# EAGLE board VCFA_bjt (EAGLE 9.4.2)
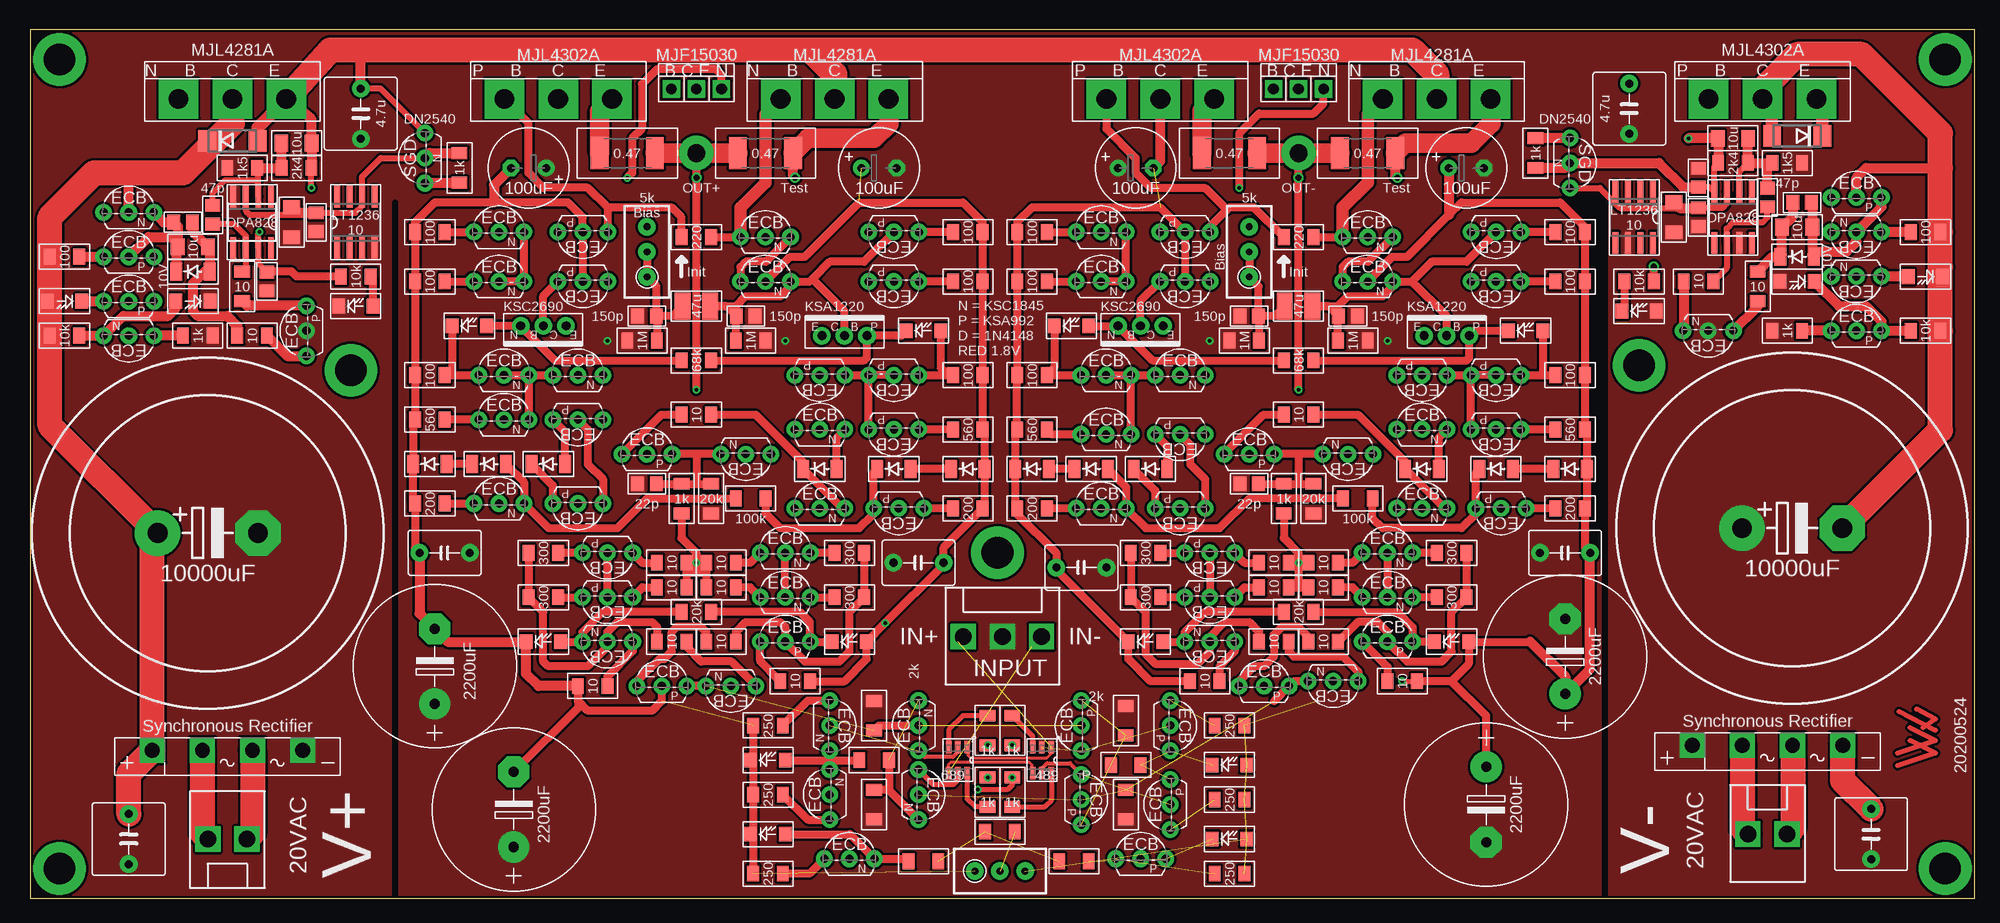
[diagram p3: board, top side]
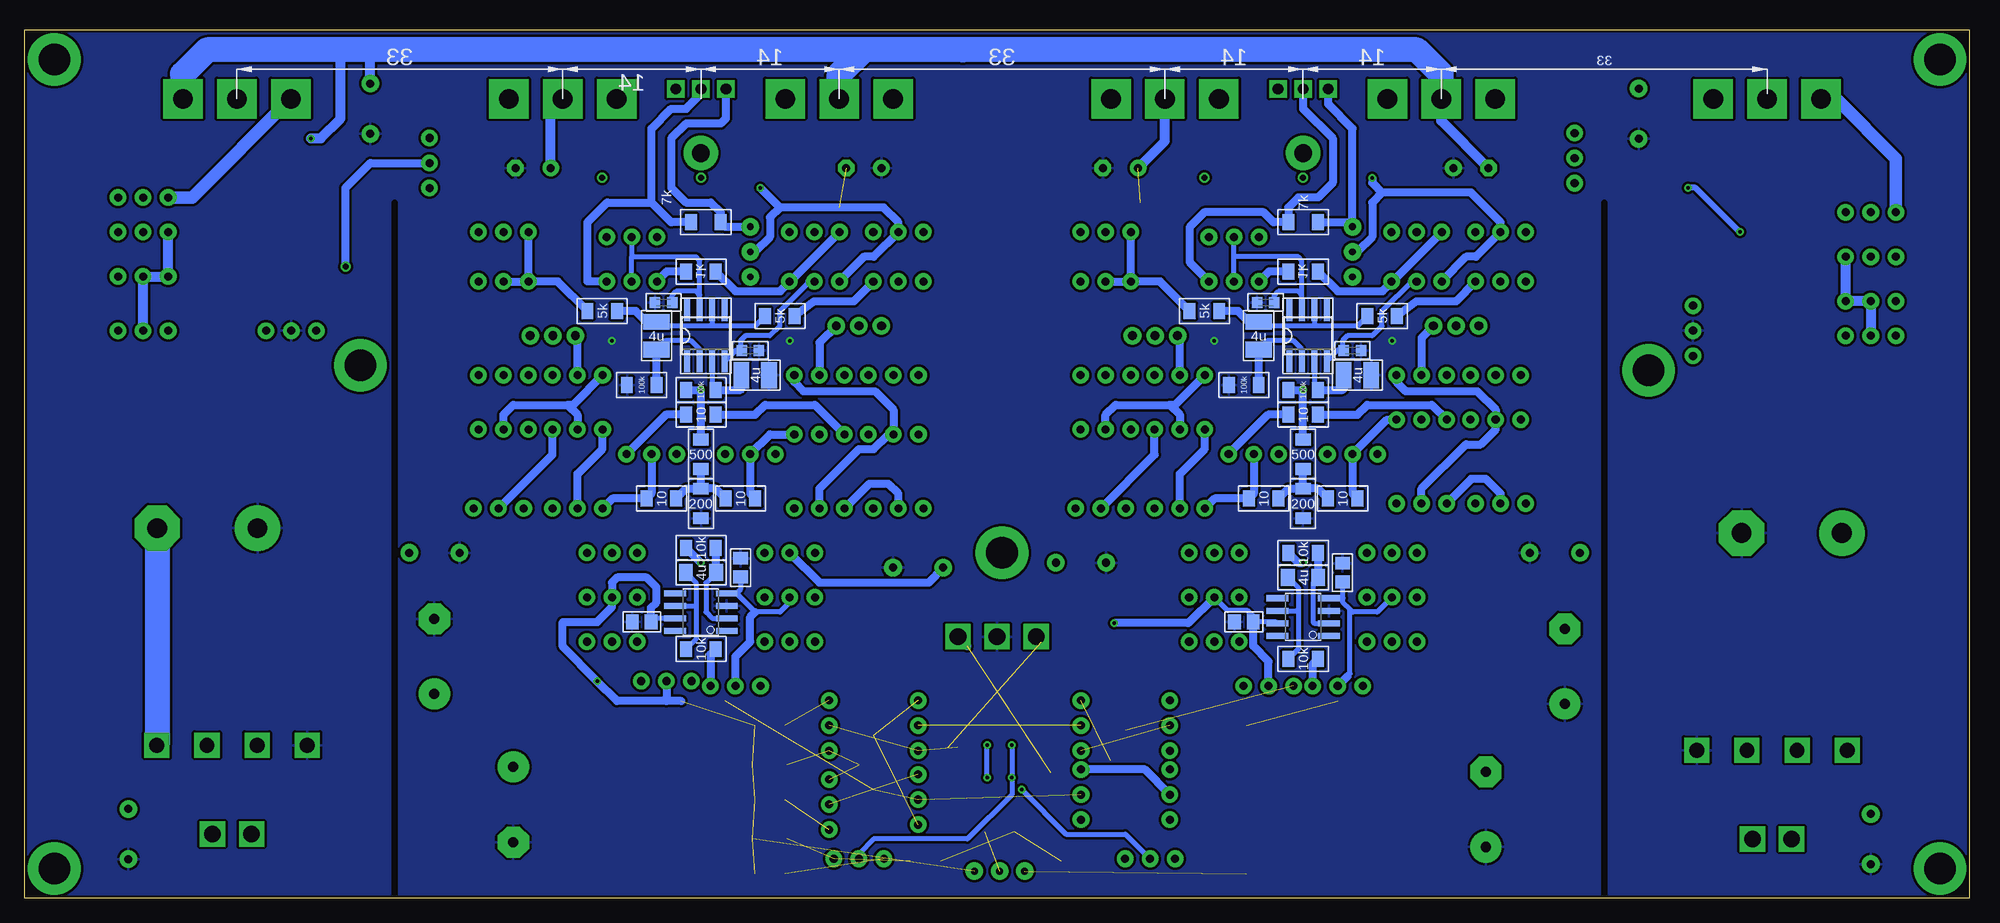
[diagram p4: board, bottom side, seen from below]

Size 197 x 88 mm. Coordinates in mm from the lower left corner, seen from the top.
Outline: 0,0 197,0 197,88 0,88 0,0
Copper layers (1*16): Top 0.035mm / dielectric 1.5mm / Bottom 0.035mm
Design rules "default *": minimum track width 6mil, minimum drill 0.35mm, track to track 6mil, track to pad 6mil, pad to pad 6mil, via to via 6mil, smd to smd 0mil, copper to edge 10mil, drill to drill 6mil, minimum pad ring 10mil, minimum via ring 8mil, stop-mask expansion 4mil, vias tented up to drill 0.35mm, thermal gap 10mil
tRestrict: 2 lines
bRestrict: 2 lines

## Footprints (pad centres in the part's own frame; a part is rotated, then mirrored left to right if it is on the bottom)
GBU4S = drill 1.499 pad 2.54 square: + 7.62,0; - -7.62,0; AC1 2.54,0; AC2 -2.54,0
E7,5-16 = drill 1.016 pad 3.15: + -3.81,0 | drill 1.016 pad 3.15 octagon: - 3.81,0
C0805 = smd 1.3 x 1.5: 1 -0.95,0; 2 0.95,0
C050-045X075 = drill 0.813 pad 1.778: 1 -2.54,0; 2 2.54,0
C1206 = smd 1.4 x 1.7: 1 -1.527,0; 2 1.527,0
C1210 = smd 1.6 x 2.7: 1 -1.4,0; 2 1.4,0
C0603K = smd 1.05 x 1.08: 1 -0.875,0; 2 0.875,0
E3,5-8 = drill 0.813 pad 1.676: + -1.778,0 | drill 0.813 pad 1.676 octagon: - 1.778,0
EB35D = drill 2.007 pad 4.597: + -5.08,0 | drill 2.007 pad 4.597 octagon: - 5.08,0
C050-075X075 = drill 0.813 pad 1.778: 1 -2.54,0; 2 2.54,0
SOD80C = smd 1.2 x 1.8: A 1.7,0; C -1.7,0
DO214AA = smd 1.8 x 2.2: A 2.55,0; C -2.55,0
SO8 = smd 0.6 x 2.2: 1 -1.905,-2.6; 2 -0.635,-2.6; 3 0.635,-2.6; 4 1.905,-2.6; 5 1.905,2.6; 6 0.635,2.6; 7 -0.635,2.6; 8 -1.905,2.6
M3_HOLE = drill 3.2 pad 5.334: P$1 0,0
SO08 = smd 0.61 x 2.21: 1 -1.905,-2.616; 2 -0.635,-2.616; 3 0.635,-2.616; 4 1.905,-2.616; 5 1.905,2.616; 6 0.635,2.616; 7 -0.635,2.616; 8 -1.905,2.616
SOIC8 = smd 0.6 x 2.2: 1 -1.905,-2.6; 2 -0.635,-2.6; 3 0.635,-2.6; 4 1.905,-2.6; 5 1.905,2.6; 6 0.635,2.6; 7 -0.635,2.6; 8 -1.905,2.6
LED_SML1206 = smd 1.3 x 1.5: A 1.75,0; C -1.75,0
PAD-16 = drill 1.8 pad 3.5: P$1 0,0
SOT-23-6 = smd 1.27 x 0.559: 1 -1.295,0.95; 2 -1.295,0; 3 -1.295,-0.95; 4 1.295,-0.95; 5 1.295,0; 6 1.295,0.95
TRANSISTOR_TO92-ECB_P = drill 0.813 pad 1.676: B 2.54,0; C 0,0; E -2.54,0
TRANSISTOR_TO92-ECB_N = drill 0.813 pad 1.676: B 2.54,0; C 0,0; E -2.54,0
TRANSISTOR_TO126_P = drill 0.9 pad 1.778: B 2.286,0; C 0,0; E -2.286,0
TRANSISTOR_TO126_N = drill 0.9 pad 1.778: B 2.286,0; C 0,0; E -2.286,0
TRANSISTOR_TO220_BCE_N = drill 1.1 pad 1.778 square: B -2.54,0; C 0,0; E 2.54,0
TRANSISTOR_TO247_BCE_N = drill 2 pad 4 square: B -5.461,0; C 0,0; E 5.461,0
TRANSISTOR_TO247_BCE_P = drill 2 pad 4 square: B -5.461,0; C 0,0; E 5.461,0
TRANSISTOR_TO92-SGD_N = drill 0.813 pad 1.676: D 2.54,0; G 0,0; S -2.54,0
RTRIM3296W = drill 0.7 pad 1.778: 1 0,-2.54; 2 0,0; 3 0,2.54
MINI_MELF-0204W = smd 1.2 x 1.6: 1 -1.5,0; 2 1.5,0
R2512 = smd 1.8 x 3.2: 1 -2.8,0; 2 2.8,0
KK-156-3 = drill 1.7 pad 2.54 square: 1 -3.96,0; 2 0,0; 3 3.96,0
KK-156-2 = drill 1.7 pad 2.54 square: 1 -1.98,0; 2 1.98,0

## Placement (x,y rotation side)
B1  MOS_BRIDGE  [GBU4S]  20,15 180 top
B2  MOS_BRIDGE  [GBU4S]  176,15.5 180 top
C1  1000uF  [E7,5-16]  155.5,24.5 90 top
C2  1000uF  [E7,5-16]  41,23.5 90 top
C3  0.1uF  [C0805]  73.5,28 0 bottom
C4  0.1uF  [C0805]  63.5,33 90 bottom
C6  1000uF  [E7,5-16]  49,9 90 top
C7  1000uF  [E7,5-16]  147.5,9.5 270 top
C9  0.1uF  [C050-045X075]  90,34 180 top
C10  0.1uF  [C050-045X075]  106.5,33.5 180 top
C11  0.1uF  [C050-045X075]  155.5,35 180 top
C12  0.1uF  [C050-045X075]  42,35 180 top
C13  10uF  [C1206]  67.5,32.5 0 bottom
C14  0.1uF  [C0805]  134.5,28 0 bottom
C15  0.1uF  [C0805]  124.5,33.5 90 bottom
C16  10uF  [C1206]  128.5,33 0 bottom
C17  22p  [C0805]  62.5,42 180 top
C18  47u  [C1210]  67.5,60 180 top
C19  150p  [C0805]  72.5,59 180 top
C20  150p  [C0805]  62.5,59 180 top
C21  4.7uF  [C1210]  72,57 270 bottom
C22  4.7uF  [C1210]  62,53 180 bottom
C23  0.1uF  [C0603K]  71.29,60.36 180 bottom
C24  0.1uF  [C0603K]  62.5,55.5 180 bottom
C25  100uF  [E3,5-8]  86,74 0 top
C26  100uF  [E3,5-8]  50.5,74 180 top
C27  22p  [C0805]  123.5,42 180 top
C28  47u  [C1210]  128.5,60 180 top
C29  150p  [C0805]  133.5,59 180 top
C30  150p  [C0805]  123.5,59 180 top
C31  4.7uF  [C1210]  133,57 270 bottom
C32  4.7uF  [C1210]  123,53 180 bottom
C33  0.1uF  [C0603K]  132.29,60.36 180 bottom
C34  0.1uF  [C0603K]  123.5,55.5 180 bottom
C35  100uF  [E3,5-8]  145.5,74 0 top
C36  100uF  [E3,5-8]  112,74 0 top
C37  10000uF  [EB35D]  18,37 0 top
C38  10000uF  [EB35D]  178.5,37.5 0 top
C39  0.1uF  [C050-075X075]  186.5,6.5 90 top
C40  10uF  [C1206]  16.5,66 0 top
C41  10uF  [C1206]  179,68 0 top
C42  0.1uF  [C050-075X075]  10,6 270 top
C43  0.1uF  [C0805]  15.5,68.5 0 top
C44  0.1uF  [C0805]  179.5,70.5 0 top
C45  0.1uF  [C0805]  24,62.5 90 top
C46  0.1uF  [C0805]  169,73 90 top
C47  10uF  [C1206]  26.5,68.5 270 top
C48  10uF  [C1206]  166.5,69 90 top
C49  0.1uF  [C0805]  29,68.5 270 top
C50  0.1uF  [C0805]  169,69 90 top
C51  47p  [C0805]  18.5,69.25 90 top
C52  47p  [C0805]  176,71 90 top
C53  10uF  [C1206]  27,76.5 180 top
C54  10uF  [C1206]  172.5,77 180 top
C55  4.7uF  [C050-075X075]  33.5,79.5 90 top
C56  4.7uF  [C050-075X075]  162,80 270 top
D1  LL4148  [SOD80C]  95,43.5 0 top
D2  LL4148  [SOD80C]  87.5,43.5 0 top
D3  LL4148  [SOD80C]  46.5,44 0 top
D4  LL4148  [SOD80C]  40.5,44 0 top
D5  LL4148  [SOD80C]  80,43.5 0 top
D6  LL4148  [SOD80C]  52.5,44 0 top
D7  LL4148  [SOD80C]  156,43.5 0 top
D8  LL4148  [SOD80C]  148.5,43.5 0 top
D9  LL4148  [SOD80C]  107.5,43.5 0 top
D10  LL4148  [SOD80C]  101.5,43.5 0 top
D11  LL4148  [SOD80C]  141,43.5 0 top
D12  LL4148  [SOD80C]  113.5,43.5 0 top
D13  BZT55B10  [SOD80C]  16.5,63.5 0 top
D14  BZT55B10  [SOD80C]  179,65 0 top
D15  S1G  [DO214AA]  20.5,76.75 0 top
D16  S1G  [DO214AA]  179,77.25 180 top
D17  LT1236-10  [SO8]  33,68.5 0 top
D18  LT1236-10  [SO8]  162.5,69 180 top
H1  HOLE  [M3_HOLE]  3,3 0 top
H2  HOLE  [M3_HOLE]  194,3 0 top
H3  HOLE  [M3_HOLE]  3,85 0 bottom
H4  HOLE  [M3_HOLE]  194,85 0 top
H5  HOLE  [M3_HOLE]  32.5,53.5 0 top
H6  HOLE  [M3_HOLE]  98,35 0 top
H7  HOLE  [M3_HOLE]  163,54 0 top
IC1  LTC2057HV  [SO08]  67.5,28.5 90 bottom
IC2  LTC2057HV  [SO08]  128.5,29 90 bottom
IC3  LTC2057HV  [SOIC8]  67,57 0 bottom
IC4  LTC2057HV  [SOIC8]  128,57 0 bottom
IC5  OPA827  [SOIC8]  172.5,69 180 top
IC6  OPA827  [SOIC8]  22.5,68.5 180 top
LED1  RED  [LED_SML1206]  121.5,6 0 top
LED2  RED  [LED_SML1206]  74.75,6.5 0 top
LED3  RED  [LED_SML1206]  121.5,13.5 0 top
LED4  RED  [LED_SML1206]  74.75,14 0 top
LED5  RED  [LED_SML1206]  83,26 0 top
LED6  RED  [LED_SML1206]  52,26 0 top
LED7  RED  [LED_SML1206]  144,26 0 top
LED8  RED  [LED_SML1206]  113,26 0 top
LED9  RED  [LED_SML1206]  90.5,57.5 0 top
LED10  RED  [LED_SML1206]  44.5,58 0 top
LED11  RED  [LED_SML1206]  151.5,57.5 0 top
LED12  RED  [LED_SML1206]  105.5,58 0 top
LED13  RED  [LED_SML1206]  16.5,60.5 180 top
LED14  RED  [LED_SML1206]  179,62.5 180 top
LED15  RED  [LED_SML1206]  3.5,60.5 180 top
LED16  RED  [LED_SML1206]  192,63 180 top
LED17  RED  [LED_SML1206]  33,60 0 top
LED18  RED  [LED_SML1206]  163,59.5 0 top
PAD1  PAD  [PAD-16]  67.5,75.5 0 top
PAD2  PAD  [PAD-16]  128.5,75.5 0 top
Q1  LSK689  [SOT-23-6]  94,14 270 top
Q2  KSA992  [TRANSISTOR_TO92-ECB_P]  112.5,4 0 top
Q3  KSC1845  [TRANSISTOR_TO92-ECB_N]  83,4 0 top
Q4  LSK489  [SOT-23-6]  102.5,14 270 top
Q5  KSA992  [TRANSISTOR_TO92-ECB_P]  115.5,9.5 90 top
Q6  KSC1845  [TRANSISTOR_TO92-ECB_N]  90,10.5 270 top
Q7  KSC1845  [TRANSISTOR_TO92-ECB_N]  90,17.5 90 top
Q8  KSA992  [TRANSISTOR_TO92-ECB_P]  106.5,10 270 top
Q9  KSC1845  [TRANSISTOR_TO92-ECB_N]  71,21.5 180 top
Q10  KSA992  [TRANSISTOR_TO92-ECB_P]  64,21.5 0 top
Q11  KSA992  [TRANSISTOR_TO92-ECB_P]  76.5,26 0 top
Q12  KSC1845  [TRANSISTOR_TO92-ECB_N]  58.5,26 180 top
Q13  KSC1845  [TRANSISTOR_TO92-ECB_N]  76.5,35 0 top
Q14  KSA992  [TRANSISTOR_TO92-ECB_P]  58.5,35 180 top
Q15  KSC1845  [TRANSISTOR_TO92-ECB_N]  76.5,30.5 0 top
Q16  KSA992  [TRANSISTOR_TO92-ECB_P]  58.5,30.5 180 top
Q17  KSC1845  [TRANSISTOR_TO92-ECB_N]  132,22 180 top
Q18  KSA992  [TRANSISTOR_TO92-ECB_P]  125,21.5 0 top
Q19  KSA992  [TRANSISTOR_TO92-ECB_P]  137.5,26 0 top
Q20  KSC1845  [TRANSISTOR_TO92-ECB_N]  119.5,26 180 top
Q21  KSC1845  [TRANSISTOR_TO92-ECB_N]  137.5,35 0 top
Q22  KSA992  [TRANSISTOR_TO92-ECB_P]  119.5,35 180 top
Q23  KSC1845  [TRANSISTOR_TO92-ECB_N]  137.5,30.5 0 top
Q24  KSA992  [TRANSISTOR_TO92-ECB_P]  119.5,30.5 180 top
Q25  KSA992  [TRANSISTOR_TO92-ECB_P]  88,39.5 180 top
Q26  KSA992  [TRANSISTOR_TO92-ECB_P]  62.5,45 0 top
Q27  KSC1845  [TRANSISTOR_TO92-ECB_N]  72.5,45 180 top
Q28  KSC1845  [TRANSISTOR_TO92-ECB_N]  47.5,40 0 top
Q29  KSC1845  [TRANSISTOR_TO92-ECB_N]  80,47.5 0 top
Q30  KSC1845  [TRANSISTOR_TO92-ECB_N]  80,39.5 0 top
Q31  KSA992  [TRANSISTOR_TO92-ECB_P]  55.5,48.5 180 top
Q32  KSA992  [TRANSISTOR_TO92-ECB_P]  55.5,40 180 top
Q33  KSA992  [TRANSISTOR_TO92-ECB_P]  87.5,47.5 180 top
Q34  KSC1845  [TRANSISTOR_TO92-ECB_N]  48,48.5 0 top
Q35  KSA992  [TRANSISTOR_TO92-ECB_P]  87.5,53 180 top
Q36  KSA992  [TRANSISTOR_TO92-ECB_P]  80,53 180 top
Q37  KSC1845  [TRANSISTOR_TO92-ECB_N]  55.5,53 0 top
Q38  KSC1845  [TRANSISTOR_TO92-ECB_N]  48,53 0 top
Q39  KSA1220  [TRANSISTOR_TO126_P]  82.5,57 0 top
Q40  KSC2690  [TRANSISTOR_TO126_N]  52,58 180 top
Q41  KSA992  [TRANSISTOR_TO92-ECB_P]  87.5,62.5 180 top
Q42  KSC1845  [TRANSISTOR_TO92-ECB_N]  47.5,62.5 0 top
Q43  KSA992  [TRANSISTOR_TO92-ECB_P]  87.5,67.5 180 top
Q44  KSC1845  [TRANSISTOR_TO92-ECB_N]  47.5,67.5 0 top
Q45  MJE15030  [TRANSISTOR_TO220_BCE_N]  67.5,82 0 top
Q46  KSC1845  [TRANSISTOR_TO92-ECB_N]  74.5,62.5 0 top
Q47  KSA992  [TRANSISTOR_TO92-ECB_P]  56,62.5 180 top
Q48  KSC1845  [TRANSISTOR_TO92-ECB_N]  74.5,67 0 top
Q49  KSA992  [TRANSISTOR_TO92-ECB_P]  56,67.5 180 top
Q50  MJL4281A  [TRANSISTOR_TO247_BCE_N]  81.5,81 0 top
Q51  MJL4302A  [TRANSISTOR_TO247_BCE_P]  53.5,81 0 top
Q52  KSA992  [TRANSISTOR_TO92-ECB_P]  149,39.5 180 top
Q53  KSA992  [TRANSISTOR_TO92-ECB_P]  123.5,45 0 top
Q54  KSC1845  [TRANSISTOR_TO92-ECB_N]  133.5,45 180 top
Q55  KSC1845  [TRANSISTOR_TO92-ECB_N]  108.5,39.5 0 top
Q56  KSC1845  [TRANSISTOR_TO92-ECB_N]  141,47.5 0 top
Q57  KSC1845  [TRANSISTOR_TO92-ECB_N]  141,39.5 0 top
Q58  KSA992  [TRANSISTOR_TO92-ECB_P]  116.5,47 180 top
Q59  KSA992  [TRANSISTOR_TO92-ECB_P]  116.5,39.5 180 top
Q60  KSA992  [TRANSISTOR_TO92-ECB_P]  148.5,47.5 180 top
Q61  KSC1845  [TRANSISTOR_TO92-ECB_N]  109,47 0 top
Q62  KSA992  [TRANSISTOR_TO92-ECB_P]  148.5,53 180 top
Q63  KSA992  [TRANSISTOR_TO92-ECB_P]  141,53 180 top
Q64  KSC1845  [TRANSISTOR_TO92-ECB_N]  116.5,53 0 top
Q65  KSC1845  [TRANSISTOR_TO92-ECB_N]  109,53 0 top
Q66  KSA1220  [TRANSISTOR_TO126_P]  143.5,57 0 top
Q67  KSC2690  [TRANSISTOR_TO126_N]  112.5,58 180 top
Q68  KSA992  [TRANSISTOR_TO92-ECB_P]  148.5,62.5 180 top
Q69  KSC1845  [TRANSISTOR_TO92-ECB_N]  108.5,62.5 0 top
Q70  KSA992  [TRANSISTOR_TO92-ECB_P]  148.5,67.5 180 top
Q71  KSC1845  [TRANSISTOR_TO92-ECB_N]  108.5,67.5 0 top
Q72  MJE15030  [TRANSISTOR_TO220_BCE_N]  128.5,82 0 top
Q73  KSC1845  [TRANSISTOR_TO92-ECB_N]  135.5,62.5 0 top
Q74  KSA992  [TRANSISTOR_TO92-ECB_P]  117,62.5 180 top
Q75  KSC1845  [TRANSISTOR_TO92-ECB_N]  135.5,67 0 top
Q76  KSA992  [TRANSISTOR_TO92-ECB_P]  117,67.5 180 top
Q77  MJL4281A  [TRANSISTOR_TO247_BCE_N]  142.5,81 0 top
Q78  MJL4302A  [TRANSISTOR_TO247_BCE_P]  114.5,81 0 top
Q79  KSC1845  [TRANSISTOR_TO92-ECB_N]  10,57 180 top
Q80  KSA992  [TRANSISTOR_TO92-ECB_P]  185,57.5 0 top
Q81  KSA992  [TRANSISTOR_TO92-ECB_P]  10,60.5 0 top
Q82  KSC1845  [TRANSISTOR_TO92-ECB_N]  185,63 180 top
Q83  KSA992  [TRANSISTOR_TO92-ECB_P]  10,65 0 top
Q84  KSC1845  [TRANSISTOR_TO92-ECB_N]  185,67.5 180 top
Q85  KSA992  [TRANSISTOR_TO92-ECB_P]  28,57.5 90 top
Q86  KSC1845  [TRANSISTOR_TO92-ECB_N]  170,57.5 180 top
Q87  KSC1845  [TRANSISTOR_TO92-ECB_N]  10,69.5 0 top
Q88  KSA992  [TRANSISTOR_TO92-ECB_P]  185,71 0 top
Q89  MJL4281A  [TRANSISTOR_TO247_BCE_N]  20.5,81 0 top
Q90  MJL4302A  [TRANSISTOR_TO247_BCE_P]  175.5,81 0 top
Q91  DN2540  [TRANSISTOR_TO92-SGD_N]  40,75 90 top
Q92  DN2540  [TRANSISTOR_TO92-SGD_N]  156,74.5 270 top
Q93  KSA992  [TRANSISTOR_TO92-ECB_P]  115.5,17.5 270 top
Q94  KSA992  [TRANSISTOR_TO92-ECB_P]  106.5,17.5 90 top
Q95  KSC1845  [TRANSISTOR_TO92-ECB_N]  81,17.5 270 top
Q96  KSC1845  [TRANSISTOR_TO92-ECB_N]  81,10.5 90 top
R1  5k  [RTRIM3296W]  98.25,2.75 270 top
R2  10K  [MINI_MELF-0204W]  98.25,6.75 0 top
R3  10K  [MINI_MELF-0204W]  105.75,3.75 0 top
R4  10K  [MINI_MELF-0204W]  90.5,3.75 0 top
R5  250  [MINI_MELF-0204W]  121.5,2.5 0 top
R6  1K  [MINI_MELF-0204W]  97,17 270 top
R7  250  [MINI_MELF-0204W]  74.75,2.5 0 top
R8  1K  [MINI_MELF-0204W]  97,10.75 90 top
R9  1K  [MINI_MELF-0204W]  99.5,17 90 top
R10  1K  [MINI_MELF-0204W]  99.5,10.75 270 top
R11  2k  [MINI_MELF-0204W]  85.5,18.5 270 top
R12  250  [MINI_MELF-0204W]  121.5,17.5 0 top
R13  250  [MINI_MELF-0204W]  74.75,17.5 0 top
R14  10K  [MINI_MELF-0204W]  111,13.5 0 top
R15  10K  [MINI_MELF-0204W]  111,18 270 top
R16  10K  [MINI_MELF-0204W]  85.5,9.5 270 top
R17  10K  [MINI_MELF-0204W]  85.5,14 0 top
R18  250  [MINI_MELF-0204W]  121.5,10 0 top
R19  250  [MINI_MELF-0204W]  74.75,10.5 0 top
R20  2k  [MINI_MELF-0204W]  111,9.5 90 top
R21  10K  [MINI_MELF-0204W]  67.5,24.25 0 bottom
R22  20K  [MINI_MELF-0204W]  67.5,29 0 top
R23  250  [MINI_MELF-0204W]  77.5,22 0 top
R24  10  [MINI_MELF-0204W]  70,26 180 top
R25  10  [MINI_MELF-0204W]  65,26 180 top
R26  250  [MINI_MELF-0204W]  57,21.5 0 top
R27  300  [MINI_MELF-0204W]  83,35 0 top
R28  300  [MINI_MELF-0204W]  52,35 0 top
R29  10K  [MINI_MELF-0204W]  67.5,35 0 bottom
R30  10  [MINI_MELF-0204W]  70,34 0 top
R31  10  [MINI_MELF-0204W]  65,34 0 top
R32  300  [MINI_MELF-0204W]  83,30.5 0 top
R33  300  [MINI_MELF-0204W]  52,30.5 0 top
R34  10  [MINI_MELF-0204W]  70,31.5 0 top
R35  10  [MINI_MELF-0204W]  65,31.5 0 top
R36  10K  [MINI_MELF-0204W]  128.5,25.25 0 bottom
R37  20K  [MINI_MELF-0204W]  128.5,29 0 top
R38  250  [MINI_MELF-0204W]  139,22 0 top
R39  10  [MINI_MELF-0204W]  131,26 180 top
R40  10  [MINI_MELF-0204W]  126,26 180 top
R41  250  [MINI_MELF-0204W]  119,22 0 top
R42  300  [MINI_MELF-0204W]  144,35 0 top
R43  300  [MINI_MELF-0204W]  113,35 0 top
R44  10K  [MINI_MELF-0204W]  128.5,35.5 0 bottom
R45  10  [MINI_MELF-0204W]  131,34 0 top
R46  10  [MINI_MELF-0204W]  126,34 0 top
R47  300  [MINI_MELF-0204W]  144,30.5 0 top
R48  300  [MINI_MELF-0204W]  113,30.5 0 top
R49  10  [MINI_MELF-0204W]  131,31.5 0 top
R50  10  [MINI_MELF-0204W]  126,31.5 0 top
R51  1k  [MINI_MELF-0204W]  66,40.5 270 top
R52  20k  [MINI_MELF-0204W]  69,40.5 90 top
R53  100k  [MINI_MELF-0204W]  73,40.5 0 top
R54  200  [MINI_MELF-0204W]  95,39.5 0 top
R55  10  [MINI_MELF-0204W]  67.5,49 0 top
R56  10  [MINI_MELF-0204W]  67.5,49 180 bottom
R57  200  [MINI_MELF-0204W]  40.5,40 0 top
R58  560  [MINI_MELF-0204W]  95,47.5 0 top
R59  10  [MINI_MELF-0204W]  71.5,40.5 180 bottom
R60  10  [MINI_MELF-0204W]  63.5,40.5 180 bottom
R61  560  [MINI_MELF-0204W]  40.5,48.5 0 top
R62  100  [MINI_MELF-0204W]  95,53 0 top
R63  200  [MINI_MELF-0204W]  67.5,40 90 bottom
R64  100  [MINI_MELF-0204W]  40.5,53 0 top
R65  68k  [MINI_MELF-0204W]  67.5,54.5 0 top
R66  500  [MINI_MELF-0204W]  67.5,45 90 bottom
R67  100  [MINI_MELF-0204W]  95,62.5 0 top
R68  5k  [MINI_MELF-0204W]  77.5,59.5 180 bottom
R69  5k  [MINI_MELF-0204W]  59.5,59 180 bottom
R70  100  [MINI_MELF-0204W]  40.5,62.5 0 top
R71  100  [MINI_MELF-0204W]  95,67.5 0 top
R72  100  [MINI_MELF-0204W]  40.5,67.5 0 top
R73  7k  [MINI_MELF-0204W]  67.5,68.5 180 bottom
R74  5k  [RTRIM3296W]  62.5,65.5 0 top
R75  1M  [MINI_MELF-0204W]  73,56.5 0 top
R76  1M  [MINI_MELF-0204W]  62,56.5 0 top
R77  1k  [MINI_MELF-0204W]  67.5,63.5 180 bottom
R78  220  [MINI_MELF-0204W]  67.5,67 0 top
R79  100k  [MINI_MELF-0204W]  73.5,52 0 bottom
R80  0.5  [R2512]  74.5,75.5 0 top
R81  0.5  [R2512]  60.5,75.5 0 top
R82  100k  [MINI_MELF-0204W]  67.5,51.5 0 bottom
R83  1k  [MINI_MELF-0204W]  127,40.5 270 top
R84  20k  [MINI_MELF-0204W]  130,40.5 90 top
R85  100k  [MINI_MELF-0204W]  134.5,40.5 0 top
R86  200  [MINI_MELF-0204W]  156,39.5 0 top
R87  10  [MINI_MELF-0204W]  128.5,49 0 top
R88  10  [MINI_MELF-0204W]  128.5,49 180 bottom
R89  200  [MINI_MELF-0204W]  101.5,39.5 0 top
R90  560  [MINI_MELF-0204W]  156,47.5 0 top
R91  10  [MINI_MELF-0204W]  132.5,40.5 180 bottom
R92  10  [MINI_MELF-0204W]  124.5,40.5 180 bottom
R93  560  [MINI_MELF-0204W]  101.5,47.5 0 top
R94  100  [MINI_MELF-0204W]  156,53 0 top
R95  200  [MINI_MELF-0204W]  128.5,40 90 bottom
R96  100  [MINI_MELF-0204W]  101.5,53 0 top
R97  68k  [MINI_MELF-0204W]  128.5,54.5 0 top
R98  500  [MINI_MELF-0204W]  128.5,45 90 bottom
R99  100  [MINI_MELF-0204W]  156,62.5 0 top
R100  5k  [MINI_MELF-0204W]  138.5,59.5 180 bottom
R101  5k  [MINI_MELF-0204W]  120.5,59 180 bottom
R102  100  [MINI_MELF-0204W]  101.5,62.5 0 top
R103  100  [MINI_MELF-0204W]  156,67.5 0 top
R104  100  [MINI_MELF-0204W]  101.5,67.5 0 top
R105  7k  [MINI_MELF-0204W]  128,68.5 180 bottom
R106  5k  [RTRIM3296W]  123.5,65.5 0 top
R107  1M  [MINI_MELF-0204W]  134,56.5 0 top
R108  1M  [MINI_MELF-0204W]  123,56.5 0 top
R109  1k  [MINI_MELF-0204W]  128.5,63.5 180 bottom
R110  220  [MINI_MELF-0204W]  128.5,67 0 top
R111  100k  [MINI_MELF-0204W]  134.5,52 0 bottom
R112  0.5  [R2512]  135.5,75.5 0 top
R113  0.5  [R2512]  121.5,75.5 0 top
R114  100k  [MINI_MELF-0204W]  128.5,51.5 0 bottom
R115  10k  [MINI_MELF-0204W]  3.5,57 0 top
R116  10k  [MINI_MELF-0204W]  192,57.5 0 top
R117  1k  [MINI_MELF-0204W]  17,57 0 top
R118  1k  [MINI_MELF-0204W]  178,57.5 0 top
R119  100  [MINI_MELF-0204W]  3.5,65 0 top
R120  10  [MINI_MELF-0204W]  22.5,57 0 top
R121  10  [MINI_MELF-0204W]  175,62 90 top
R122  100  [MINI_MELF-0204W]  192,67.5 0 top
R123  10  [MINI_MELF-0204W]  21.5,62 270 top
R124  10  [MINI_MELF-0204W]  169,62.5 180 top
R125  1k  [MINI_MELF-0204W]  43.5,74 270 top
R126  1k  [MINI_MELF-0204W]  152.5,75.5 90 top
R127  1.5k  [MINI_MELF-0204W]  27,74 0 top
R128  1.5k  [MINI_MELF-0204W]  21.5,74 0 top
R129  1.5k  [MINI_MELF-0204W]  178,74.5 0 top
R130  1.5k  [MINI_MELF-0204W]  172.5,74.5 0 top
R131  10k  [MINI_MELF-0204W]  33,63 180 top
R132  10k  [MINI_MELF-0204W]  163,62.5 180 top
S1  VWV  [VWV]  193,16 90 top
X1  KK-156-3  [KK-156-3]  98.5,26.5 0 top
X3  KK-156-2  [KK-156-2]  20,6 180 top
X4  KK-156-2  [KK-156-2]  176,6.5 0 top

## Tracks (layer width: path | path; a pad name or v marks a point on that pad's centre or on a via)
BOUT+  (via drill 0.35)
  Top 0.813: R31.2 66.5,33 | 66.5,33 R35.2 | R30.1 68.5,33 | 68.5,33 R34.1 | 66.5,33 67.5,33 | 67.5,33 68.5,33 | R51.2 66,36.5 67.5,35 v67.5,34 67.5,33
  Bottom 0.813: R29.1 68,34 v67.5,34
BOUT-  (via drill 0.35)
  Top 0.813: R46.2 v128.5,34 | v128.5,34 R45.1 | R50.2 128.5,31.5 | 128.5,31.5 R49.1 | v128.5,34 128.5,31.5 | R83.2 127,36.5 128.5,35 v128.5,34
  Bottom 0.813: R44.1 v128.5,34
GND  (via drill 0.35)
  other vias: 137.5,56.5 119.5,56.5 76.5,56.5 58.5,56.5
  pour Bottom (isolate 0.254): -0.5,88.49 196.94,88.49 196.94,-0.04 -0.5,-0.04
  pour Top (isolate 0.254, no thermals): -0.5,88.49 196.94,88.49 196.94,86.99 196.94,-0.04 -0.5,-0.04
IN+  (1 unrouted)
  Top 0.305: Q1.1 95,15.24 95,14.5 95.25,14.25 103,14.25 103.5,14.75 103.5,15.24 Q4.1
  Top 0.508: 103.5,15.35 Q4.1
  Bottom 0.813: X1.1 94,25.96
IN-  (1 unrouted)
  Top 0.305: Q4.4 101.5,12.76 101.5,13.5 101.25,13.75 93.25,13.75 93,13.5 93,12.76 Q1.4
  Bottom 0.813: X1.3 101.5,25.54
N$1
  Bottom 1.016: Q79.C Q81.C Q81.B Q83.B
N$2  (1 unrouted)
N$3
  Top 0.813: R54.1 Q25.E
N$4
  Top 0.813: R24.2 68.5,27 68,27.5 65.5,27.5 65,27 65,25 64.25,24.25 63.75,24.25 61.46,21.96 Q10.E
N$5
  Top 0.813: R26.2 58.5,22.5 61.04,25.04 Q12.E
N$6
  Top 0.813: R23.1 73.96,24.04 Q11.E
N$7
  Top 0.813: LED5.C Q11.B 79,26.04 79,28 78,29 R22.2
N$8
  Top 0.813: R22.1 58,29 55.96,26.96 Q12.B LED6.A
N$9
  Top 0.813: R24.1 71.5,27 72.5,28 76,28 76.5,27.5 Q11.C 78.5,24 82,24 83,25 83,29 R32.2 R27.2
N$10
  Top 0.813: R25.2 63.5,27.5 63,28 59.5,28 58.5,27 Q12.C 58.5,25.5 56.5,23.5 52.5,23.5 52,24 52,29 R33.1 R28.1
N$11
  Top 0.813: Q9.E 71.04,24 68,24 66.5,25.5 R25.1
N$12
  Top 0.813: D5.A 81.7,46.66 Q29.B
  Bottom 0.813: Q25.C 82.54,44.96 Q29.B
N$13
  Top 0.813: R27.1 Q13.B
N$14
  Top 0.813: Q13.E 72.96,34 R30.2
N$15
  Top 0.813: R33.2 Q16.B
N$16
  Top 0.813: Q15.B R32.1
N$17
  Top 0.813: Q14.B R28.2
N$18
  Top 0.813: Q14.E 62.04,34 R31.1
N$19
  Bottom 0.508: C13.2 66.5,31.97 66.5,28 66.36,27.86 IC1.2
  Bottom 0.813: R29.2 66,32.53 C13.2
N$20
  Top 0.813: Q15.E 72.96,31.5 R34.2
N$21
  Top 0.813: Q16.E 62.04,31.5 R35.1
N$22
  Bottom 0.508: C13.1 68,31.47 68,29 | R21.1 68,25.25 68,29 | IC1.6 68.14,29.14 68,29
N$23  (1 unrouted)
N$24  (2 unrouted)
N$25
  Top 0.813: D1.C D2.A
N$26
  Top 0.813: D2.C 85.46,43.16 Q25.B 85.46,38.96 84,37.5 76,37.5 74.5,39 R53.2
N$27
  Top 0.813: R55.2 73.5,49 78.3,44.2 D5.C 82.3,39.5 Q30.B
N$28
  Bottom 0.813: Q29.E 77.46,45.54 80,43 Q30.C
N$29
  Bottom 0.813: Q27.C 72.5,41 R59.2 76.46,40.5 Q30.E
N$30
  Bottom 0.813: R60.2 66,41.5 R63.2 | R59.1 69,41.5 R63.2 | R63.2 R66.1
N$31
  Bottom 0.813: R60.1 62.5,41 Q26.C 59,48.5 Q31.E
N$32
  Top 0.813: D6.A 54.2,47.26 Q31.B
  Bottom 0.813: R56.1 62,49 61,50 54.46,50 Q31.B
N$33
  Top 0.813: D6.C 52.96,41.84 Q32.B
  Bottom 0.813: Q28.C 47.5,41 49,42.5 50.46,42.5 Q32.B
N$34
  Top 0.813: R57.2 Q28.E
N$35
  Top 0.813: D3.C D4.A
N$36
  Top 0.813: Q31.C 56.5,47.5 56.5,44 58.04,42.46 Q32.E
N$37
  Top 0.813: Q26.E 63.96,49 R55.1
N$38
  Bottom 0.813: R56.2 71.04,49 Q27.E
N$39
  Top 0.813: 67.5,42 R51.1 C17.1 | 67.5,42 R52.2 | Q27.B 67.5,45 | 67.5,45 Q26.B | 67.5,45 67.5,42
N$40
  Bottom 0.813: Q33.C 87.5,49 86.5,50 81,50 | 81,50 80,49 Q29.C | Q36.B 80.46,50 81,50
N$41
  Top 0.813: Q33.B Q35.B | Q35.C Q35.B | Q36.E Q35.B
N$42
  Top 0.813: R58.1 Q33.E
N$43
  Top 0.813: Q20.E 122.04,25.04 120.5,23.5 R41.2
N$44
  Top 0.813: Q19.E 137.5,23.46 R38.1
N$45
  Top 0.813: R37.2 138.5,29 140.04,27.46 Q19.B LED7.C
N$46
  Top 0.813: LED8.A Q20.B 116.96,26.96 119,29 R37.1
N$47
  Top 0.813: R39.1 134.5,28 136.5,28 137.5,27 Q19.C 139.5,24 143,24 144,25 144,29 R47.2 R42.2
N$48
  Top 0.813: R43.1 R48.1 113,29 113,24.75 114,23.75 118.25,23.75 119.5,25 Q20.C 119.5,26.5 121,28 123.5,28 124.5,27 R40.2
N$49
  Top 0.813: R39.2 129.5,26.5 128.5,27.5 126.81,27.5 126,26.69 126,24.5 125,23.5 124,23.5 122.46,21.96 Q18.E
N$50
  Top 0.813: Q17.E 134.54,22.96 133,24.5 128,24.5 127.5,25 R40.1
N$51
  Top 0.813: Q35.E 93,53 | 93,53 R62.1 | 93,53 92.25,53.75 LED9.A
N$52
  Top 0.813: R42.1 Q21.B
N$53
  Top 0.813: R43.2 Q22.B
N$54
  Top 0.813: R47.1 Q23.B
N$55
  Top 0.813: Q24.B R48.2
N$56
  Top 0.813: Q21.E 133.96,34 R45.2
N$57
  Top 0.813: Q22.E 123.04,34 R46.1
N$58
  Top 0.813: Q23.E 133.96,31.5 R49.2
N$59
  Top 0.813: Q24.E 123.04,31.5 R50.1
N$60
  Bottom 0.508: C16.2 128,31.97 128,29 127.36,28.36 IC2.2
  Bottom 0.813: R44.2 127,33.03 C16.2
N$61
  Bottom 0.508: C16.1 129,31.97 129,29.5 | R36.1 129,26.25 129,29.5 | IC2.6 129.13,29.64 129,29.5
N$62
  Bottom 0.813: Q36.C 80,56.79 Q39.E
N$63
  Top 0.813: LED9.C 88.25,57 Q39.B 84.79,54.79 84.5,54.5 R65.2
N$64
  Top 0.813: Q34.B Q38.B | Q38.C Q38.B | Q38.B Q37.E
N$65
  Top 0.813: R64.2 42.5,53 | 42.5,53 Q38.E | LED10.C 42.75,53.25 42.5,53
N$66
  Top 0.813: Q34.E R61.2
N$67
  Bottom 0.813: Q32.C 55.5,41.5 51,46 49.5,46 48,47.5 Q34.C 48,49.5 49.88,51.38 57.14,51.38 58.04,52.29 Q37.B
N$68
  Bottom 0.813: Q40.E 55.5,56.79 Q37.C
N$69
  Top 0.813: R65.1 53.21,54.5 Q40.B LED10.A
N$70
  Top 0.813: R75.1 71.5,58.95 C19.2 70.55,60 C18.1 71.5,60 72.5,61 76,61 77.04,62.04 Q46.B 79,62.5 79.25,62.75 | Q43.C 84.5,64.5 81,64.5 79.25,62.75 | Q39.C 82.5,59.5 79.25,62.75
  Bottom 0.813: Q45.C 67.5,80 64.5,77 64.5,72.5 66,71 68,71 69,70 R73.2 70.5,68.5 71.5,69.5 77.5,69.5 79,68 79,64.46 Q46.B
N$71
  Bottom 0.813: R68.2 82,62.5 Q41.B | Q41.C Q41.B | Q41.B Q43.B
N$72
  Top 0.813: Q42.C Q42.B Q44.B
  Bottom 0.813: R69.1 56,60.5 52,60.5 50.04,62.46 Q42.B
N$73
  Top 0.813: R67.1 Q41.E
N$74
  Top 0.813: R71.1 Q43.E
N$75
  Top 1.016: LED15.C Q81.E
N$76
  Top 0.813: R70.2 Q42.E
N$77
  Top 0.813: R72.2 Q44.E
N$78
  Top 0.813: Q48.B 74.54,64.5 72.5,64.5 71.96,63.96 Q46.E
  Bottom 0.813: R77.2 70.96,63.5 Q46.E
N$79
  Bottom 0.813: Q49.B 58.46,62.5 | 58.46,62.5 Q47.E | R77.1 64,61.5 59.46,61.5 58.46,62.5
N$80  (via drill 0.35)
  Top 0.813: R74.2 R74.1 63.45,62.01 C20.1 | C20.1 63.5,58.95 R76.2 | C18.2 65.1,59 C20.1 | Q40.C 52,61.04 Q47.B | Q45.E 70.04,83.46 69.5,84 63.5,84 62,82.5 62,78 61,77 61,73.5 v60.5,73
  Bottom 0.813: Q47.B 53.46,62.54 51,65 50,65 Q44.C 47.5,68.5 50.5,71.5 59.5,71.5 | R74.2 62,65.5 60.5,67 60.5,70.5 59.5,71.5 | v60.5,73 60.5,72.5 59.5,71.5
N$81
  Top 0.813: R78.2 Q48.E
  Top 1.27: Q50.B 74.5,79.46 74.5,72.5 71.96,69.96 Q48.E
N$82
  Top 0.813: R78.1 66,69 65.04,69.96 58.54,69.96 | Q49.E 58.54,69.96 | 58.54,69.96 56.5,72 52,72 50.5,73.5 50.5,78.54 Q51.B
N$83  (via drill 0.6)
  Top 1.016: v77.5,73 77.3,73.2 R80.2
  Top 2: R80.2 78.8,77 85.5,77 87,78.5 87,80.96 Q50.E
N$84
  Top 2: R81.1 57.7,79.74 Q51.E
N$85
  Bottom 0.508: IC3.2 67.64,55.63 68.5,56.5 71.1,56.5 71.8,55.8
  Bottom 0.813: R79.2 C21.2 71.8,55.8
N$86
  Bottom 0.508: IC3.3 66.36,51.87 R82.2
  Bottom 0.813: R82.2 63.5,51.5 63.4,51.6 C22.2
N$87
  Top 0.813: D3.A 50.04,42.16 Q28.B 52.54,37.5 59.5,37.5 62.5,40.5 R53.1
N$88
  Bottom 0.813: R73.1 62.96,68.5 R74.3 62.5,78 64.96,80.46 Q45.B
N$89
  Bottom 0.508: C21.1 71.6,58 66.5,58 | IC3.6 66.36,58.13 66.5,58 | R69.2 62,58 66.5,58
  Bottom 0.813: C21.1 73,58.4 74.1,59.5 R68.1
N$90
  Top 1.016: R119.2 Q83.E
N$91
  Top 1.016: Q87.C 10,73.5 | LED15.A 2,60.5
  Top 1.27: 19,77 18.75,76.75 D15.C
  Top 2.54: C42.1 10,12.62 B1.+ 12.38,36.46 C37.+ 2,47.92 R115.1 2,60.5 R119.1 2,69 6.5,73.5 10,73.5 15.5,73.5 19,77 20.5,78.5 Q89.C
N$92  (1 unrouted)
N$93
  Top 0.813: R13.2 78.79,20.04 Q95.E
N$94
  Top 0.813: R19.2 78.79,7.96 Q96.E
N$95
  Top 0.508: Q1.5 94,12 93.5,11.5 91.5,11.5 90,13 Q6.E
  Bottom 0.813: Q96.C 83.54,13.04 Q6.E
N$96  (1 unrouted)
  Top 0.406: Q1.2 94,14.83 93.48,14.3 90.66,14.3 Q7.E
N$97
  Top 0.813: LED4.A 81,14 | 81,14 R17.1 | Q95.B 81,14 | Q96.B 81,14
N$98  (1 unrouted)
  Top 0.813: Q6.B 86.96,11 | 86.96,11 R16.1 | R17.2 87,11.04 86.96,11
N$99
  Top 0.813: LED2.A 83.04,6.5 Q3.B 88.75,4 R4.1
N$100
  Top 1.016: D13.C 14.8,65.83 C40.1 14.97,67 | 14.97,67 14.97,68.08 C43.1 13.54,68.5 Q87.B | Q83.C 12,67 14.97,67
N$101  (3 unrouted)
N$102  (2 unrouted)
N$103  (3 unrouted)
N$104  (1 unrouted)
  Top 0.406: Q4.5 102.5,13.17 103.02,13.7 105.34,13.7 Q8.E
N$105
  Top 1.016: C43.2 16.45,67.58 C40.2 18.2,65.83 D13.A 17.7,63.5 16.5,62.3 16.5,59.5 17,59 20,59 21,58 R120.1
N$106
  Top 1.016: R120.2 26.04,54.96 Q85.E
N$107
  Top 1.016: R117.1 Q79.E
N$108  (2 unrouted)
N$109  (1 unrouted)
N$110  (via drill 0.35)
  Bottom 0.508: R6.2 R8.2 97,10.5 101.5,6 111,6 112.5,4.5 Q2.C
  other vias: 97,15.5 97,12.25
N$111
  Top 0.508: R8.1 95.75,9.25 94.95,10.05 Q1.6
N$112
  Top 0.508: R6.1 94.5,18.5 93.05,17.05 Q1.3
N$113
  Top 1.016: LED13.A 14.75,59.75 14,59 9.46,59 Q79.B R115.2
N$114
  Top 1.016: Q80.E R118.2
N$115
  Top 0.508: R9.2 101.55,16.45 Q4.3
N$116
  Top 0.508: R10.2 102.75,9.25 103.5,10 103.5,12.65 Q4.6
N$117  (via drill 0.35)
  Top 0.508: R10.1 99.5,11.5 99,11 v96,11
  Bottom 0.508: R10.1 R9.1 | v96,11 91.5,6.5 85.5,6.5 Q3.C
  other vias: 99.5,12.25 99.5,15.5
N$118
  Top 0.813: Q3.E 78.96,2.5 R7.2
N$119
  Top 1.016: LED14.C 183.25,60 186,60 187.54,58.46 Q80.B R116.1
N$120
  Top 1.016: Q86.E 175,59.96 R121.1
N$121
  Top 1.016: R121.2 176.5,65 D14.C 177.47,65.17 C41.1 178.55,69.08 C44.1
N$122
  Top 1.016: C44.2 180.53,70.42 C41.2 180.53,65.17 D14.A 181.2,65.5 184,65.5 185,66.5 Q84.C 187.54,70.04 Q88.B
N$123
  Bottom 1.016: Q80.C Q82.C Q82.B Q84.B
N$124
  Top 1.016: R122.1 Q84.E
N$125
  Top 1.016: LED16.A Q82.E
N$126
  Bottom 1.27: Q90.B 180.04,71 Q88.E
N$127
  Bottom 1.27: Q87.E 7.46,74.96 13.5,81 Q89.B
N$128
  Top 0.61: R123.1 21.86,63.87 IC6.6 21.86,67.14 20.7,68.3 C51.1
N$129
  Top 0.61: R124.1 171.87,63.87 IC5.6 171.87,67.86 172.5,68.5 175.5,68.5 176,69 C52.1
N$130
  Top 1.016: R124.2 167.5,57.54 Q86.B
N$131
  Top 1.016: Q85.B 21.96,60.04 R123.2
N$132
  Top 0.61: C51.2 18.5,71.5 19.74,72.74 23.13,72.74 23.14,72.75 | IC6.2 23.14,72.75 | 23.14,72.75 23.14,73.86 R128.2
  Top 1.016: R128.2 R127.1 25.47,74.03 C53.2
N$133
  Top 0.61: IC6.3 21.86,69.64 22.25,69.25 26.88,69.25 27.08,69.45 | C49.1 32.95,69.45 33.63,70.14 D17.6 33.63,73.11 35.52,75 Q91.G
  Top 1.016: C47.1 27.08,69.45 C49.1 | Q91.G 40.5,75.5 R125.1
N$134
  Top 1.016: Q91.S 40.04,72.5 R125.2
N$135
  Top 0.61: IC5.3 171.87,70.36 171.45,69.95 C50.2 | D18.4 160.59,70.41 | 167.08,69.95 161.05,69.95 160.59,70.41 | Q92.D 159.04,71.96 160.59,70.41
  Top 1.016: C48.2 167.08,69.95 C50.2
N$136
  Top 0.61: 152.54,77.04 R126.2
  Top 1.016: Q92.S 152.54,77.04
N$137
  Top 0.61: IC5.2 173.13,73.64 R130.2
  Top 1.016: C54.1 174,76.97 R130.2 R129.1 176,74 C52.2
N$138
  Top 0.813: R132.2 161.5,59.75 LED18.C
N$139
  Top 0.813: LED17.A 34.75,62.75 R131.1
N$142
  Top 1.016: 176,80.5 Q90.C | 193.5,64 193.5,63.25 LED16.C | Q88.C 185,73 186,74 193.5,74
  Top 1.27: D16.A 176.45,80.05 176,80.5
  Top 2.54: C38.- 193.5,47.42 R116.2 193.5,64 R122.2 193.5,74 193.5,77.5 185.5,85.5 179,85.5 175.5,82 Q90.C | C39.2 183.62,11.92 B2.-
  Bottom 2.54: C38.- 183.58,15.54 B2.-
N$144
  Top 2.54: B1.AC2 22.54,6.56 X3.1
N$145
  Top 2.54: B1.AC1 17.46,6.56 X3.2
N$146
  Top 2.54: B2.AC2 178.54,7.06 X4.2
N$147
  Top 2.54: B2.AC1 173.46,7.06 X4.1
N$159
  Top 0.813: R86.1 Q52.E
N$160
  Top 0.813: D11.A 142.7,46.66 Q56.B
  Bottom 0.813: Q52.C 143.54,44.96 Q56.B
N$161
  Top 0.813: D7.C D8.A
N$162
  Top 0.813: D8.C 146.46,43.16 Q52.B 146.46,38.96 145,37.5 137,37.5 136,38.5 R85.2
N$163
  Top 0.813: R87.2 134.5,49 139.3,44.2 D11.C 143.3,39.5 Q57.B
N$164
  Bottom 0.813: Q56.E 138.46,45.54 141,43 Q57.C
N$165
  Bottom 0.813: Q54.C 133.5,41 R91.2 137.46,40.5 Q57.E
N$166
  Bottom 0.813: R92.2 127,41.5 R95.2 | R91.1 130,41.5 R95.2 | R95.2 R98.1
N$167
  Bottom 0.813: R92.1 123.5,41 Q53.C 121.5,47 Q58.E
N$168
  Top 0.813: D12.A 115.2,45.76 Q58.B
  Bottom 0.813: R88.1 123,49 122,50 116.96,50 Q58.B
N$169
  Top 0.813: D12.C 113.96,41.34 Q59.B
  Bottom 0.813: Q55.C 108.5,41 109.5,42 111.46,42 Q59.B
N$170
  Top 0.813: Q55.E R89.2
N$171
  Top 0.813: D9.C D10.A
N$172
  Top 0.813: Q58.C 117.5,46 117.5,44 119.04,42.46 Q59.E
N$173
  Top 0.813: Q53.E 124.96,49 R87.1
N$174
  Bottom 0.813: R88.2 132.04,49 Q54.E
N$175
  Top 0.813: 128.5,42 R83.1 C27.1 | 128.5,42 R84.2 | Q54.B 128.5,45 | 128.5,45 Q53.B | 128.5,45 128.5,42
N$176
  Bottom 0.813: Q60.C 148.5,49 147.5,50 142,50 | 142,50 141,49 Q56.C | Q63.B 141.46,50 142,50
N$177
  Top 0.813: Q60.B Q62.B | Q62.C Q62.B | Q63.E Q62.B
N$178
  Top 0.813: R90.1 Q60.E
N$179
  Top 0.813: Q62.E 153,53 | 153,53 R94.1 | LED11.A 153.25,53.25 153,53
N$180
  Bottom 0.813: Q63.C 141,56.79 Q66.E
N$181
  Top 0.813: R97.2 145.5,54.5 145.79,54.79 Q66.B 146.29,57.5 LED11.C
N$182
  Top 0.813: Q61.B Q65.B | Q65.C Q65.B | Q65.B Q64.E
N$231
  Top 0.813: Q65.E R96.2 103.75,53.75 LED12.C
N$232
  Top 0.813: R93.2 103.5,47 Q61.E
N$233
  Bottom 0.813: Q59.C 116.5,41.5 112.5,45.5 111,45.5 109.5,47 Q61.C 109,49.5 110.88,51.38 118.14,51.38 119.04,52.29 Q64.B
N$234
  Bottom 0.813: Q67.E 116.5,56.29 Q64.C
N$235
  Top 0.813: R97.1 113.71,54.5 Q67.B LED12.A
N$236
  Top 0.813: R107.1 132.5,58.95 C29.2 131.55,60 C28.1 132.5,60 133.5,61 137,61 138.04,62.04 Q73.B 140,62.5 | Q70.C 145.5,64.5 142,64.5 140,62.5 | Q66.C 143.5,59 140,62.5
  Bottom 0.813: Q73.B 140,62.5 140,68.5 138,70.5 133.5,70.5 | R105.2 131.5,68.5 133.5,70.5 | 133.5,70.5 133.5,78 131.5,80 130,80 128.5,81.5 Q72.C
N$237
  Bottom 0.813: R100.2 143,62.5 Q68.B | Q68.C Q68.B | Q68.B Q70.B
N$238
  Top 0.813: Q69.C Q69.B Q71.B
  Bottom 0.813: R101.1 117,60.5 113,60.5 111.04,62.46 Q69.B
N$239
  Top 0.813: R99.1 Q68.E
N$240
  Top 0.813: R103.1 Q70.E
N$242
  Top 0.813: R102.2 Q69.E
N$243
  Top 0.813: R104.2 Q71.E
N$244
  Top 0.813: Q75.B 135.54,64.5 133.5,64.5 132.96,63.96 Q73.E
  Bottom 0.813: R109.2 131.96,63.5 Q73.E
N$245
  Bottom 0.813: Q76.B 119.46,62.5 | 119.46,62.5 Q74.E | R109.1 125,61.5 120.46,61.5 119.46,62.5
N$246  (via drill 0.35)
  Top 0.813: R106.2 R106.1 124.45,62.01 C30.1 | C30.1 124.5,58.95 R108.2 | C28.2 126.1,59 C30.1 | Q67.C 112.5,60.54 Q74.B | v122.5,72 122.5,77.5 124.5,79.5 130,79.5 131,80.5 131,81.96 Q72.E
  Bottom 0.813: Q74.B 114.46,62.54 112,65 111,65 Q71.C 108.5,68.5 110,70 120.5,70 | R106.2 123,65.5 121.5,67 121.5,69 120.5,70 | 120.5,70 v122.5,72
N$247
  Top 0.813: R110.2 Q75.E
  Top 1.27: Q77.B 135.5,79.46 135.5,72.5 132.96,69.96 Q75.E
N$248
  Top 0.813: R110.1 124,70 121.5,70 121.25,69.75 | 121.25,69.75 119.54,68.04 Q76.E | Q78.B 109.04,77.96 112,75 112,73.5 113.5,72 119,72 121.25,69.75
N$249  (via drill 0.6)
  Top 1.016: v138.5,73 138.3,73.2 R112.2
  Top 2: R112.2 139.3,76.5 146,76.5 148,78.5 148,80.96 Q77.E
N$250
  Top 2: R113.1 118.7,79.74 Q78.E
N$251
  Bottom 0.508: IC4.2 128.63,55.63 129.5,56.5 132.1,56.5 132.8,55.8
  Bottom 0.813: R111.2 C31.2 132.8,55.8
N$252
  Bottom 0.508: IC4.3 127.36,51.87 R114.2
  Bottom 0.813: R114.2 124.5,51.5 124.4,51.6 C32.2
N$253
  Top 0.813: D9.A 111.04,41.66 Q55.B 113.04,37.5 120.5,37.5 123.5,40.5 R85.1
N$254
  Bottom 0.813: Q72.B 125.96,79.04 126.5,78.5 130,78.5 131.5,77 131.5,72 130,70.5 127.5,70.5 126.5,69.5 R105.1 126.04,68.04 R106.3
N$255
  Bottom 0.508: C31.1 132.6,58 127.5,58 | IC4.6 127.36,58.13 127.5,58 | R101.2 123,58 127.5,58
  Bottom 0.813: C31.1 134,58.4 135.1,59.5 R100.1
OUT+  (via drill 0.35, 0.6)
  Top 0.813: v67.5,51.5 v67.5,73 PAD1.P$1
  Top 2: R81.2 PAD1.P$1 R80.1
  Bottom 0.813: R66.2 v67.5,51.5 R82.1
OUT-  (via drill 0.35, 0.6)
  Top 0.813: v128.5,51.5 v128.5,73 PAD2.P$1
  Top 2: R112.1 PAD2.P$1 R113.2
  Bottom 0.813: R98.2 v128.5,51.5 R114.1
UOUT+  (2 unrouted)
  Top 0.813: Q9.B Q10.B | R11.2 86,17.5 Q7.C
  Bottom 0.813: R21.2 66.54,23.71 Q10.B
UOUT-  (3 unrouted)
  Top 0.813: 126.04,20 Q18.B 128.04,22 Q17.B
  Bottom 0.813: R36.2 127.54,24.71 Q18.B
V+  (via drill 0.35)  (7 unrouted)
  Top 0.508: v139,22 R38.2
  Top 0.61: C45.2 23.14,64.31 IC6.7 23.14,67.39 v23.25,67.5 | v28.5,72 R127.2 | Q91.D 35.5,82.04 C55.2
  Top 0.813: Q15.C Q13.C | Q73.C 138,65 139.5,65 143.75,69.25 145,70.5 155,70.5 157.5,68 R103.2 R99.2 R94.2 R90.2 157.7,47.3 D7.A 157.7,39.7 R86.2 157.5,35.54 C11.1 | Q46.C 77,65 78.5,65 84,70.5 94.5,70.5 96.5,68.5 R71.2 R67.2 R62.2 R58.2 96.7,47.3 D1.A 96.7,39.7 R54.2 92.54,35.54 C9.1 92.54,33.79 v86.62,27.88 LED5.A 84.75,24.25 82.5,22 R23.2 | Q21.C Q23.C | 144,22 145.75,23.75 LED7.A 151.96,26 | 144,22 R38.2 | C7.+ 147.5,18.5 144,22 | R131.2 27,63 26.5,63.5 24.05,63.5 C45.2
  Top 1.016: R127.2 28.53,74.03 C53.1 28.53,78.93 Q89.E | C55.2 33.5,85.98 | 151.96,26 155.5,22.46 C1.+ 158,23.19 158,34.96 C11.1 | C35.+ 143.75,73.97 143.75,69.25
  Top 1.27: D15.A 23.05,78.09 Q89.E
  Top 2.54: Q89.E 30.44,85.98 33.5,85.98 79.02,85.98 | 79.02,85.98 81.5,83.5 Q50.C | 79.02,85.98 94,85.98 | 94,85.98 140.02,85.98 142.5,83.5 Q77.C | 94.04,85.94 94,85.98
  Bottom 0.508: 67.64,61.13 68,61.5 70,61.5 70.41,61.09 C23.1 | 67.64,61.13 67.64,64.64 68,65 74.5,65 | 128.63,61.13 128.63,64.64 129,65 135.5,65 | IC2.7 133.19,28.36 C14.2 | 74.5,65 Q48.C | Q46.C 74.5,65 | IC3.7 67.64,61.13 | IC4.7 128.63,61.13 | 128.63,61.13 129,61.5 131,61.5 131.41,61.09 C33.1 | Q73.C 135.5,65 | Q75.C 135.5,65 | IC1.7 70.25,28 C3.2 72.55,28.55 73.16,29.16 75.16,29.16 Q15.C
  Bottom 0.61: v23.25,67.5 27.75,72 v28.5,72
  Bottom 0.813: Q15.C 79.12,27.88 v86.62,27.88 | Q9.C 71,24 72.55,25.55 C3.2 | 130.5,20 132,20 | 132,20 137,20 v139,22 142.5,25.5 142.5,28 139,28 137.5,29.5 Q23.C 137.5,32 137,32.5 134,32.5 133,31.5 133,30 133.55,29.45 C14.2 | Q17.C 132,20
  Bottom 1.016: C35.+ 143.72,79.78 Q77.C | C25.+ 81.5,76.72 Q50.C
V-  (via drill 0.35, 0.6)  (3 unrouted)
  Top 0.61: C46.1 170.15,72.05 IC5.4 170.59,74.09 R130.1
  Top 0.813: Q16.C Q14.C | Q74.C Q76.C 114.5,70 101.5,70 100,68.5 R104.1 R102.1 R96.1 100,48.2 99.8,48 | 99.8,48 D10.C 99.8,39.7 R89.1 100,38.96 103.96,35 C10.2 103.96,33.29 LED8.C 111.25,24.25 113.5,22 R41.1 | Q47.C Q49.C 56,69 54.5,70.5 47,70.5 41,70.5 39,68.5 R72.1 R70.1 R64.1 39,48.2 38.8,48 | 38.8,48 38.8,48.3 R61.1 | 38.8,48 D4.C 38.8,40.2 R57.1 39,35.46 C12.2 | Q10.C 64,20 63,19 56.5,19 55.5,20 R26.1 55.5,19.31 C6.- | Q22.C Q24.C | 99.8,48 100,47.8 R93.1 | R132.1 v164.5,64 | R7.1 73.25,6.25 LED2.C 73.25,6.75 R19.1 73.25,13.75 | LED4.C 73.25,13.75 | R13.1 73.25,13.75
  Top 1.016: R130.1 171,76.97 C54.2 v168,77 | C46.1 167.45,72.05 165,74.5 Q92.G 155.5,74 R126.1 | C12.2 39.46,28.85 C2.- 42.31,26 LED6.C 50.25,22.75 51.5,21.5 R26.1 | C26.- 47,72.28 47,70.5 | C36.- 114.5,74.72 Q78.C
  Top 1.27: D16.C 181.55,80.41 Q90.E
  Bottom 0.508: 56.5,62.5 59.5,59.5 59.5,58 60.5,57 63,57 63.5,56.5 63.5,55.62 | IC4.4 125,55.5 C34.2 124.5,55.62 124.5,56.5 124,57 121.5,57 120.5,58 120.5,59.5 117.5,62.5 | IC1.4 63.45,30.41 | Q16.C 60,29 62.5,29 62.75,29.25 | 62.75,29.25 63.45,29.95 63.45,30.41 | 63,22.5 62.75,22.75 62.75,29.25 | Q24.C 119.5,30 120.5,29 123,29 124.91,30.91 | IC2.4 124.91,30.91 | 63.5,55.62 C24.2 | 63.5,55.62 63.87,55.62 IC3.4 | C4.1 63.5,30.45 63.45,30.41 | C15.1 124.5,31.31 124.91,30.91
  Bottom 0.813: Q10.C 63,22.5 | Q18.C 125,24.5 123.5,26 123.5,28.5 123,29 | Q74.C 117.5,62.5 | Q47.C 56.5,62.5 | C10.2 103.96,33.46 105.42,32 116.5,32 Q22.C | v164.5,64 164.5,72 162,74.5 Q92.G
  Bottom 1.016: v168,77 167,77 165,79 165,85.98 | C56.1 162,85.98 | C26.- 53.5,78.78 Q51.C
  Bottom 2.54: Q51.C 53.5,83.5 55.98,85.98 102,85.98 | Q90.E 181,81.04 181,83.5 178.52,85.98 165,85.98 162,85.98 112,85.98 | 102,85.98 112,85.98 | Q78.C 114.5,83.48 112,85.98 | 101.96,85.94 102,85.98

## Text on the board
tPlace: MJL4281A | MJL4302A | MJF15030 | MJL4281A | MJL4302A | MJF15030 | MJL4281A | MJL4302A | 4.7u | 4.7u | DN2540 | DN2540 | 10u | 10u | 0.47 | 0.47 | 0.47 | 0.47 | 1k | 1k5 | 2k4 | 1k | 2k4 | 1k5 | 47p | 100uF | OUT+ | Test | 100uF | 100uF | OUT- | Test | 100uF | 47p | 5k | 5k | Bias | LT1236 / 10 | OPA828 | OPA828 | LT1236 / 10 | 100 | 100 | 100 | 100 | 10u | 100 | 220 | 220 | 10u | 100 | Bias | 10V | Init | Init | 10V | 10k | 10 | 100 | 100 | 100 | 100 | 10k | 10 | 10 | KSC2690 | 47u | KSA1220 | KSC2690 | 47u | KSA1220 | 150p | 150p | 150p | 150p | 1k | 10k | 10k | 1k | 10 | 1M | 1M | 1M | 1M | N = KSC1845 / P = KSA992 / D = 1N4148 / RED 1.8V | 68k | 68k | 100 | 100 | 100 | 100 | 10 | 10 | 560 | 560 | 560 | 560 | 200 | 22p | 1k | 20k | 200 | 200 | 22p | 1k | 20k | 200 | 100k | 100k | 300 | 300 | 300 | 300 | 10 | 10 | 10 | 10 | 10000uF | 10000uF | 10 | 10 | 10 | 10 | 300 | 300 | 300 | 300 | 20k | 20k | IN+ | IN- | 10 | 10 | 10 | 10 | 2200uF | 2200uF | 2k | 10 | 10 | INPUT | 10 | 10 | 2k | Synchronous Rectifier | 250 | 250 | Synchronous Rectifier | 20200524 | 1k | 1k | 689 | 489 | P | 250 | 1k | 1k | 250 | 2200uF | 2200uF | V+ | V- | 20VAC | 20VAC | 250 | 250 | Balanced / Offset | Design by Kevin Gilmore | Current Feedback Amplifier II
bPlace: 7k | 7k | 1k | 1k | 5k | 5k | 5k | 5k | 4u | 4u | 4u | 4u | 100k | 100k | 100k | 100k | 10 | 10 | 500 | 500 | 10 | 200 | 10 | 10 | 200 | 10 | 10k | 10k | 4u | 4u | 10k | 10k